# EasyEDA Pro project examples.epro, schematic Schematic5
Create Date: 2026-03-05; Page Name: P1; Project Name: EdaCopilotExamples; Schematic Name: Schematic5; Update Date: 2026-03-05; Company: EasyEDA.com; Page Size: A4; Version: V1.0
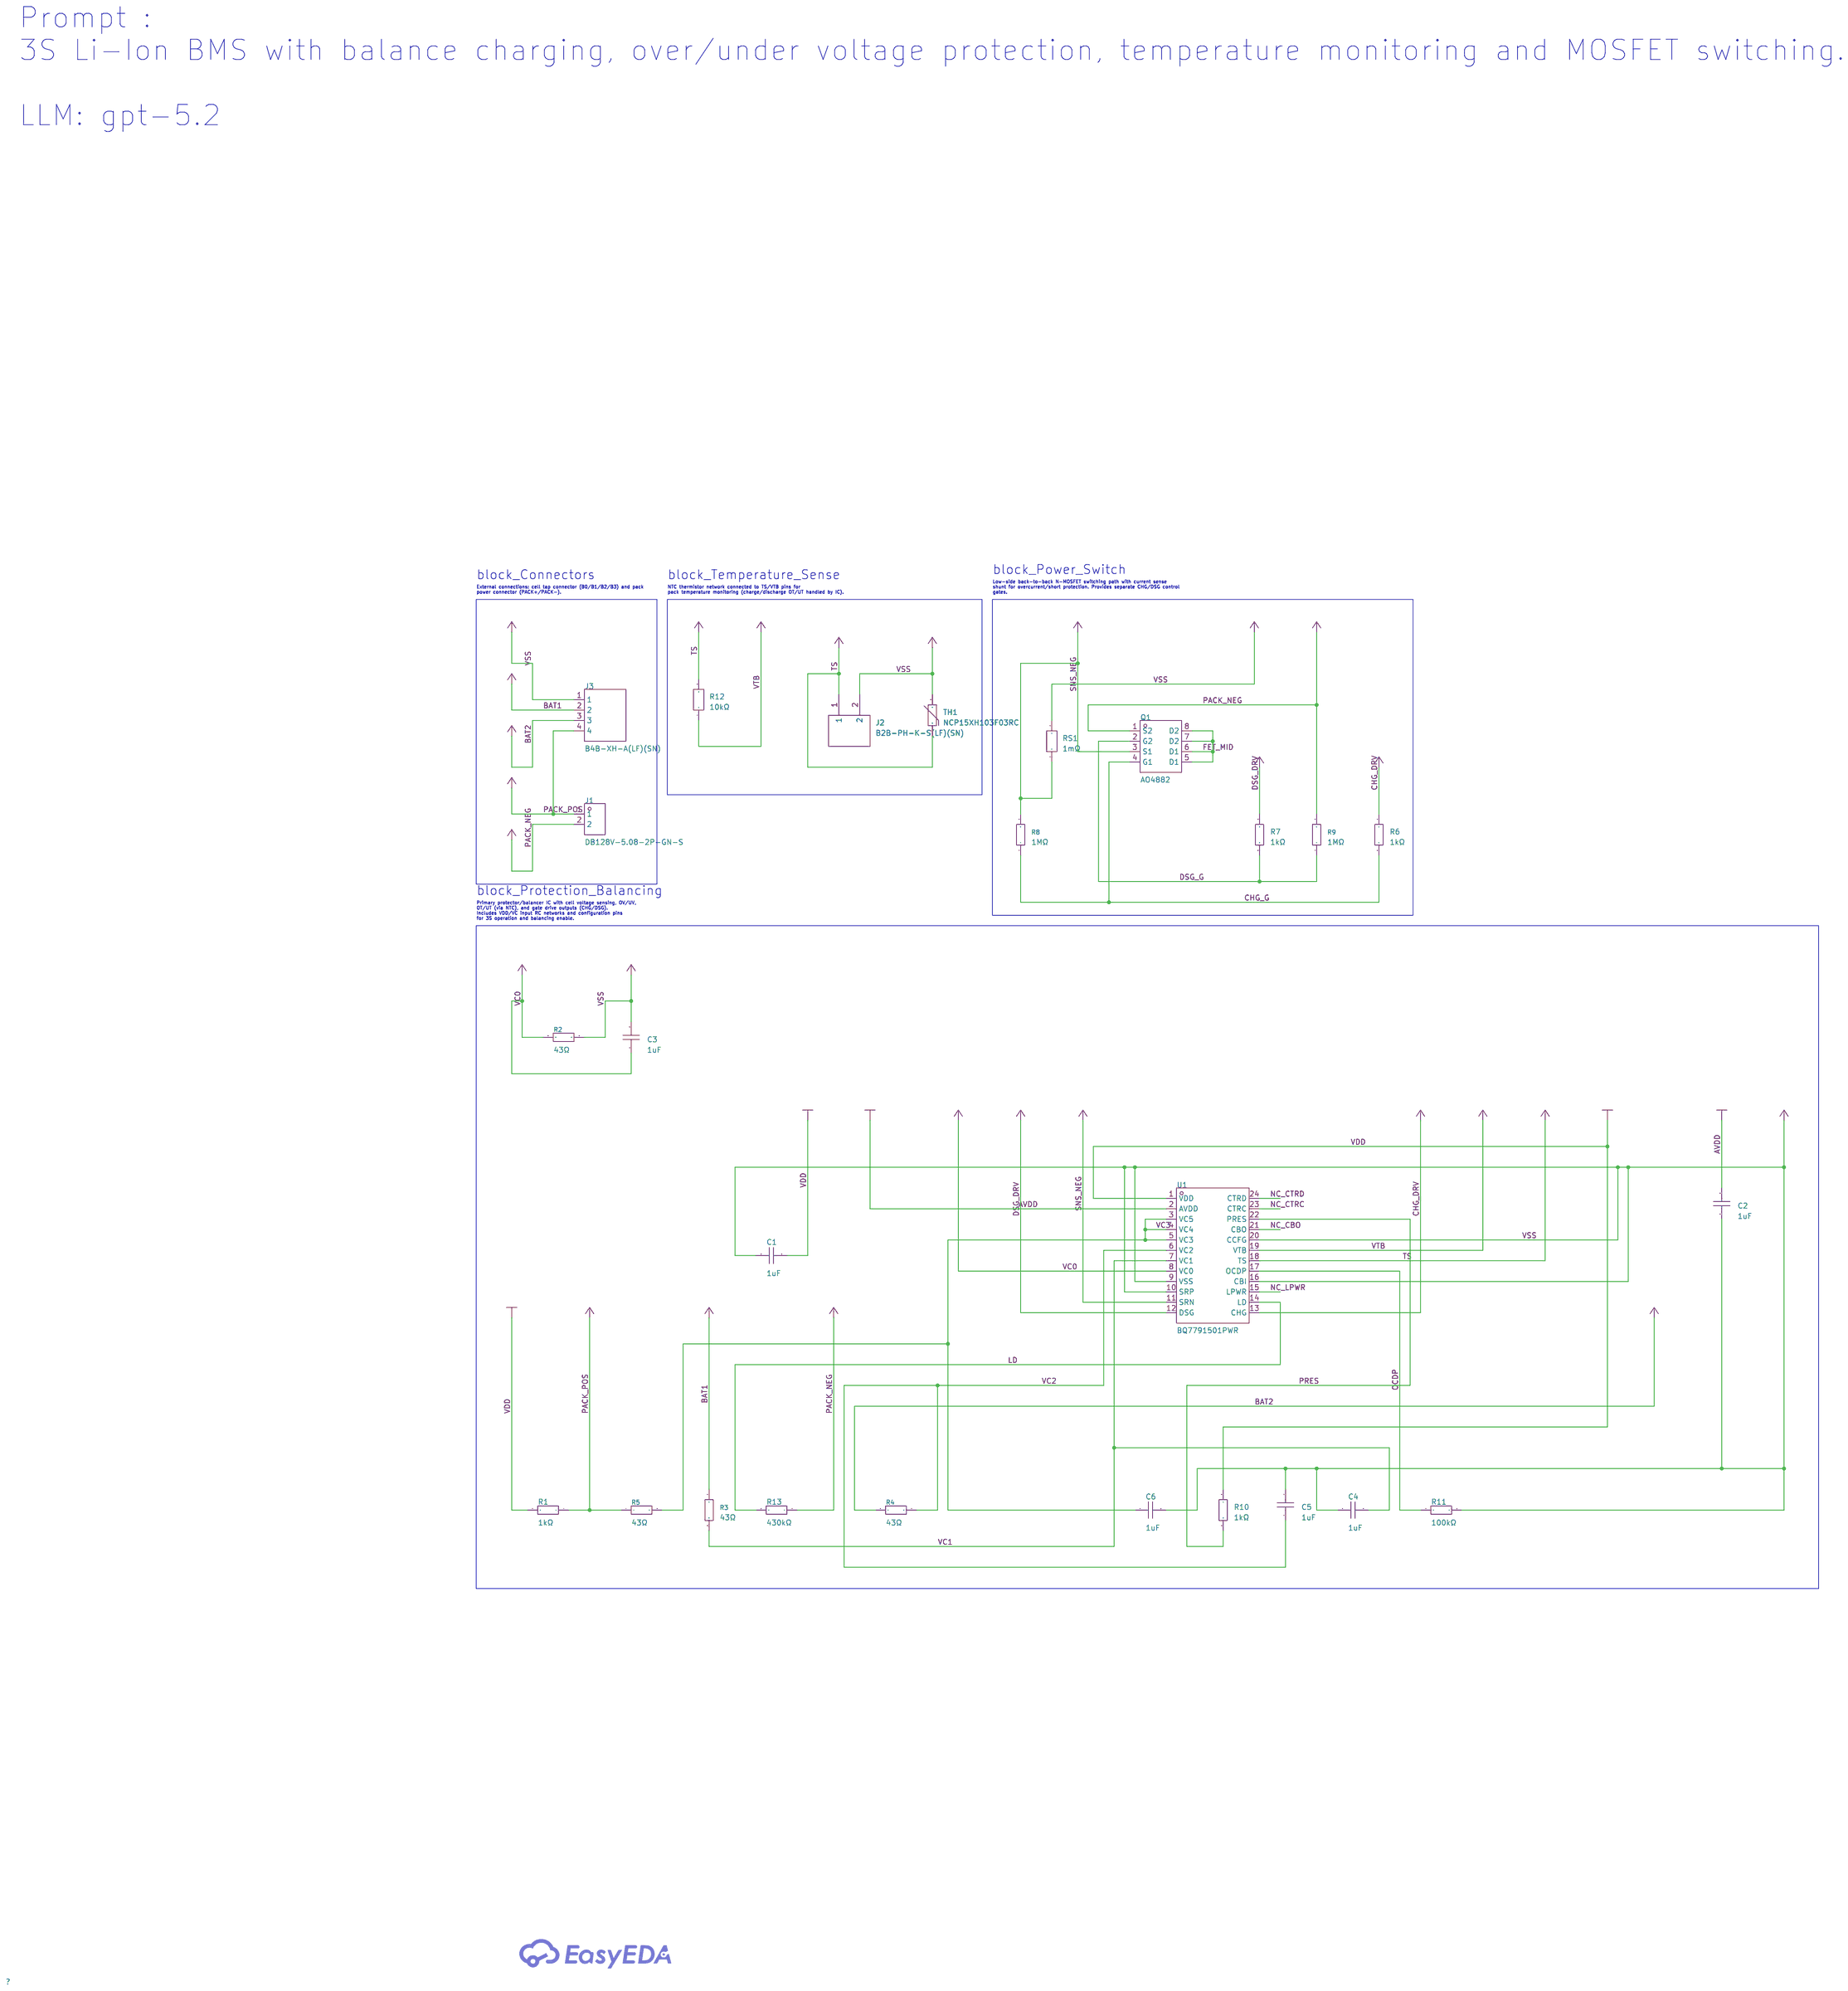
[diagram p4: schematic sheet]

## Parts
C1  1uF  [C0603]
C2  1uF  [C0603]
C3  1uF  [C0603]
C4  1uF  [C0603]
C5  1uF  [C0603]
C6  1uF  [C0603]
J1  DB128V-5.08-2P-GN-S  [CONN-TH_2P-P5.08_DIBO_DB128V-5.08]
J2  B2B-PH-K-S(LF)(SN)  [CONN-TH_B2B-PH-K-S]
J3  B4B-XH-A(LF)(SN)  [CONN-TH_B4B-XH-A-LF-SN]
Q1  AO4882  [SOIC-8_L4.9-W3.9-P1.27-LS6.0-BL]
R1  1kΩ  [R0603]
R2  43Ω  [R0402]
R3  43Ω  [R0402]
R4  43Ω  [R0402]
R5  43Ω  [R0402]
R6  1kΩ  [R0603]
R7  1kΩ  [R0603]
R8  1MΩ  [R0402]
R9  1MΩ  [R0402]
R10  1kΩ  [R0603]
R11  100kΩ  [R0402]
R12  10kΩ  [R0603]
R13  430kΩ  [R0603]
RS1  1mΩ  [R1206]
TH1  NCP15XH103F03RC  [R0402]
U1  BQ7791501PWR  [TSSOP-24_L7.8-W4.4-P0.65-LS6.4-BL]

## Library data of the parts
C1-C6 = CL10B105KA8NNNC: Capacitance:1uF Tolerance:±10% Tolerance:±10% Voltage Rating:25V Temperature Coefficient:X7R; LCSC Part Name: 1uF ±10% 25V; Supplier Part: C29936; Manufacturer: SAMSUNG(三星); Supplier Footprint: 0603; JLCPCB Part Class: Extended Part; Datasheet: https://item.szlcsc.com/datasheet/CL10B105KA8NNNC/30690.html; Supplier: LCSC; Tolerance: ±10%; Voltage Rating: 25V; Temperature Coefficient: X7R; supplier: LCSC; supplierId: C29936
J1 = DB128V-5.08-2P-GN-S: Number of Positions or Pins:1x2P Pitch:5.08mm Color:Green Mounting Type:Through Hole Number of Pins:2P Number of Rows:1 Number of PINs Per Row:2 Screw Specification:M2.5 Current Rating:16A Voltage Rating (Max):300V Wire Gauge - AWG:12~22 Wire Gauge - AWG:; LCSC Part Name: 1x2P 5.08mm 直插 排数:1 每排P数:2; Supplier Part: C2915639; Manufacturer: DORABO(地博电气); Supplier Footprint: 插件,P=5.08mm; JLCPCB Part Class: Extended Part; Datasheet: https://item.szlcsc.com/datasheet/DB128V-5.08-2P-GN-S/3209395.html; Supplier: LCSC; Number of Positions or Pins: 1x2P; Pitch: 5.08mm; Color: Green; Mounting Type: Through Hole; Number of Pins: 2P; Number of Rows: 1; Number of PINs Per Row: 2; Screw Specification: M2.5; Current Rating: 16A; Voltage Rating (Max): 300V; Wire Gauge - AWG: 12~22; Wire Gauge - mm2: 2.5; Operating Temperature: -40℃~+105℃; supplier: LCSC; supplierId: C2915639
J2 = B2B-PH-K-S(LF)(SN): Pins Structure:1x2P Pitch:2mm Mounting Type:Through Hole Reference Series:PH Number of Pins:2P Number of Rows:1 Number of PINs Per Row:2 Row Spacing:- Current Rating:2A Contact Material:Brass Contact Plating:Tin Operating Temperature:-25℃~+85℃ Operating T; LCSC Part Name: 1x2P 间距:2mm 直插 系列:PH; Supplier Part: C131337; Manufacturer: JST; Supplier Footprint: 插件,P=2mm; JLCPCB Part Class: Extended Part; Datasheet: https://item.szlcsc.com/datasheet/B2B-PH-K-S(LF)(SN)/142630.html; Supplier: LCSC; Pins Structure: 1x2P; Pitch: 2mm; Mounting Type: Through Hole; Reference Series: PH; Number of Pins: 2P; Number of Rows: 1; Number of PINs Per Row: 2; Current Rating: 2A; Contact Material: Brass; Contact Plating: Tin; Operating Temperature: -25℃~+85℃; Voltage Rating: 100V; Plastic Material: PA66; Flame Retardant Rating: UL94V-0; Supplementary Features: K Pin; Color: White; Z-Height of the Board: 6mm; X-Length of Bottom Edge on Board (Spacing Line): 5.9mm; Y-Width of Bottom Edge on Board: 4.5mm; supplier: LCSC; supplierId: C131337
J3 = B4B-XH-A(LF)(SN): Pins Structure:1x4P Pitch:2.5mm Mounting Type:Through Hole Reference Series:XH Number of Pins:4P Number of Rows:1 Number of PINs Per Row:4 Row Spacing:- Current Rating:3A Contact Material:Brass Contact Plating:Tin Operating Temperature:-25℃~+85℃ Operating; LCSC Part Name: 1x4P 间距:2.5mm 直插 系列:XH; Supplier Part: C144395; Manufacturer: JST; Supplier Footprint: 插件,P=2.5mm; JLCPCB Part Class: Extended Part; Datasheet: https://item.szlcsc.com/datasheet/B4B-XH-A(LF)(SN)/155727.html; Supplier: LCSC; Pins Structure: 1x4P; Pitch: 2.5mm; Mounting Type: Through Hole; Reference Series: XH; Number of Pins: 4P; Number of Rows: 1; Number of PINs Per Row: 4; Current Rating: 3A; Contact Material: Brass; Contact Plating: Tin; Operating Temperature: -25℃~+85℃; Voltage Rating: 250V; Plastic Material: PA66; Flame Retardant Rating: UL94V-0; Supplementary Features: K Pin; Color: White; Z-Height of the Board: 7mm; X-Length of Bottom Edge on Board (Spacing Line): 12.4mm; Y-Width of Bottom Edge on Board: 5.75mm; supplier: LCSC; supplierId: C144395
Q1 = AO4882_C477943: Number:2 N-Channel Drain to Source Voltage:40V Current - Continuous Drain(Id):40A RDS(on):27mΩ@4.5V,4A Pd - Power Dissipation:- Gate Threshold Voltage (Vgs(th)):2.4V Gate Charge(Qg):6.5nC@10V；3nC@4.5V Input Capacitance(Ciss):415pF Reverse Transfer Capacit; LCSC Part Name: 2个N沟道 耐压:40V; Supplier Part: C477943; Manufacturer: AOS; Supplier Footprint: SOIC-8; JLCPCB Part Class: Extended Part; Datasheet: https://item.szlcsc.com/datasheet/AO4882/485085.html; Supplier: LCSC; Number: 2 N-Channel; Drain to Source Voltage: 40V; Current - Continuous Drain(Id): 40A; RDS(on): 27mΩ@4.5V,4A; Gate Threshold Voltage (Vgs(th)): 2.4V; Gate Charge(Qg): 6.5nC@10V；3nC@4.5V; Input Capacitance(Ciss): 415pF; Reverse Transfer Capacitance (Crss@Vds): 11pF; Operating Temperature: -55℃~+150℃; Output Capacitance(Coss): 112pF; supplier: LCSC; supplierId: C477943
R1 R6 R7 R10 = RC0603FR-071KL: Type:Thick Film Resistor Resistance:1kΩ Tolerance:±1% Tolerance:±1% Power(Watts):100mW Voltage-Supply(Max):75V Temperature Coefficient:±100ppm/℃ Temperature Coefficient:±100ppm/℃ Operating Temperature:-55℃~+155℃ Operating Temperature:-55℃~+155℃; LCSC Part Name: 厚膜电阻 1kΩ ±1% 100mW; Supplier Part: C22548; Manufacturer: YAGEO(国巨); Supplier Footprint: 0603; JLCPCB Part Class: Extended Part; Datasheet: https://item.szlcsc.com/datasheet/RC0603FR-071KL/23274.html; Supplier: LCSC; Type: Thick Film Resistor; Tolerance: ±1%; Power(Watts): 100mW; Voltage-Supply(Max): 75V; Temperature Coefficient: ±100ppm/℃; Operating Temperature: -55℃~+155℃; supplier: LCSC; supplierId: C22548
R2-R5 = 0402WGF430JTCE: Type:Thick Film Resistor Resistance:43Ω Tolerance:±1% Tolerance:±1% Power(Watts):62.5mW Voltage-Supply(Max):50V Temperature Coefficient:±200ppm/℃ Temperature Coefficient:±200ppm/℃ Operating Temperature:-55℃~+155℃ Operating Temperature:-55℃~+155℃; LCSC Part Name: 43Ω ±1% 62.5mW 厚膜电阻; Supplier Part: C270600; Manufacturer: UNI-ROYAL(厚声); Supplier Footprint: 0402; JLCPCB Part Class: Extended Part; Datasheet: https://item.szlcsc.com/datasheet/0402WGF430JTCE/259980.html; Supplier: LCSC; Type: Thick Film Resistor; Tolerance: ±1%; Power(Watts): 62.5mW; Voltage-Supply(Max): 50V; Temperature Coefficient: ±200ppm/℃; Operating Temperature: -55℃~+155℃; supplier: LCSC; supplierId: C270600
R8 R9 = 0402WGF1004TCE: Type:Thick Film Resistor Resistance:1MΩ Tolerance:±1% Tolerance:±1% Power(Watts):62.5mW Voltage-Supply(Max):50V Temperature Coefficient:±100ppm/℃ Temperature Coefficient:±100ppm/℃ Operating Temperature:-55℃~+155℃ Operating Temperature:-55℃~+155℃; LCSC Part Name: 1MΩ ±1% 62.5mW 厚膜电阻; Supplier Part: C26083; Manufacturer: UNI-ROYAL(厚声); Supplier Footprint: 0402; JLCPCB Part Class: Basic Part; Datasheet: https://item.szlcsc.com/datasheet/0402WGF1004TCE/26826.html; Supplier: LCSC; Type: Thick Film Resistor; Tolerance: ±1%; Power(Watts): 62.5mW; Voltage-Supply(Max): 50V; Temperature Coefficient: ±100ppm/℃; Operating Temperature: -55℃~+155℃; supplier: LCSC; supplierId: C26083
R11 = RC0402FR-07100KL: Type:Thick Film Resistor Resistance:100kΩ Tolerance:±1% Tolerance:±1% Power(Watts):62.5mW Voltage-Supply(Max):50V Temperature Coefficient:±100ppm/℃ Temperature Coefficient:±100ppm/℃ Operating Temperature:-55℃~+155℃ Operating Temperature:-55℃~+155℃; LCSC Part Name: 厚膜电阻 100kΩ ±1% 62.5mW; Supplier Part: C60491; Manufacturer: YAGEO(国巨); Supplier Footprint: 0402; JLCPCB Part Class: Extended Part; Datasheet: https://item.szlcsc.com/datasheet/RC0402FR-07100KL/61543.html; Supplier: LCSC; Type: Thick Film Resistor; Tolerance: ±1%; Power(Watts): 62.5mW; Voltage-Supply(Max): 50V; Temperature Coefficient: ±100ppm/℃; Operating Temperature: -55℃~+155℃; supplier: LCSC; supplierId: C60491
R12 = FRC0603J103 TS: Type:Thick Film Resistor Resistance:10kΩ Tolerance:±5% Tolerance:±5% Power(Watts):100mW Voltage-Supply(Max):75V Temperature Coefficient:±100ppm/℃ Temperature Coefficient:±100ppm/℃ Operating Temperature:-55℃~+155℃ Operating Temperature:-55℃~+155℃; LCSC Part Name: 10kΩ ±5% 100mW 厚膜电阻; Supplier Part: C2930027; Manufacturer: FOJAN(富捷); Supplier Footprint: 0603; JLCPCB Part Class: Extended Part; Datasheet: https://item.szlcsc.com/datasheet/FRC0603J103%2520TS/3266960.html; Supplier: LCSC; Type: Thick Film Resistor; Tolerance: ±5%; Power(Watts): 100mW; Voltage-Supply(Max): 75V; Temperature Coefficient: ±100ppm/℃; Operating Temperature: -55℃~+155℃; supplier: LCSC; supplierId: C2930027
R13 = 0603WAF4303T5E: Type:Thick Film Resistor Resistance:430kΩ Tolerance:±1% Tolerance:±1% Power(Watts):100mW Voltage-Supply(Max):75V Temperature Coefficient:±100ppm/℃ Temperature Coefficient:±100ppm/℃ Operating Temperature:-55℃~+155℃ Operating Temperature:-55℃~+155℃; LCSC Part Name: 430kΩ ±1% 100mW 厚膜电阻; Supplier Part: C25969; Manufacturer: UNI-ROYAL(厚声); Supplier Footprint: 0603; JLCPCB Part Class: Extended Part; Datasheet: https://item.szlcsc.com/datasheet/0603WAF4303T5E/26712.html; Supplier: LCSC; Type: Thick Film Resistor; Tolerance: ±1%; Power(Watts): 100mW; Voltage-Supply(Max): 75V; Temperature Coefficient: ±100ppm/℃; Operating Temperature: -55℃~+155℃; supplier: LCSC; supplierId: C25969
RS1 = FRM121WFR001TM: Type:Current Sense Resistor Resistance:1mΩ Tolerance:±1% Tolerance:±1% Voltage Rating:- Power(Watts):1W Current Rating:- Temperature Coefficient:±50ppm/℃ Temperature Coefficient:±50ppm/℃ Mounting Type:-; LCSC Part Name: 1mΩ ±1% 1W; Supplier Part: C7467246; Manufacturer: FOJAN(富捷); Supplier Footprint: 1206; JLCPCB Part Class: Extended Part; Datasheet: https://item.szlcsc.com/datasheet/FRM121WFR001TM/8513846.html; Supplier: LCSC; Type: Current Sense Resistor; Tolerance: ±1%; Power(Watts): 1W; Temperature Coefficient: ±50ppm/℃; supplier: LCSC; supplierId: C7467246
TH1 = NCP15XH103F03RC: Resistance @ 25℃:10kΩ B Constant (25℃/50℃):3380K Resistance Tolerance:±1% Resistance Tolerance:±1% B Constant (25℃/75℃):- B Constant (25℃/85℃):3434K B Constant (25℃/100℃):3455K Power(Watts):100mW B Constant Tolerance:±1% Steady State Current (Max):310uA O; LCSC Part Name: 10kΩ 3380K 100mW; Supplier Part: C77131; Manufacturer: muRata(村田); Supplier Footprint: 0402; JLCPCB Part Class: Extended Part; Datasheet: https://item.szlcsc.com/datasheet/NCP15XH103F03RC/78258.html; Supplier: LCSC; Resistance @ 25℃: 10kΩ; B Constant (25℃/50℃): 3380K; Resistance Tolerance: ±1%; B Constant (25℃/85℃): 3434K; B Constant (25℃/100℃): 3455K; Power(Watts): 100mW; B Constant Tolerance: ±1%; Steady State Current (Max): 310uA; Operating Temperature: -40℃~+125℃; Dissipation Factor: 1mW/℃; Length: 1mm; Width: 0.5mm; supplier: LCSC; supplierId: C77131
U1 = BQ7791501PWR: The Chip Type:- Voltage - Supply:3V~25V Voltage - Supply:3V~25V Charge Current - Max:60mA Charging Saturation Voltage:4.2V End-Off Voltage:2.9V Type of Battery:- Number of Cells:3~5 Number of Cells:3~5 Operating Temperature:-40℃~+85℃ Operating Temperature; LCSC Part Name: 具有电池自主平衡功能和休眠模式的3节至5节串联、可堆叠超低功耗初级保护器; Supplier Part: C2876947; Manufacturer: TI(德州仪器); Supplier Footprint: TSSOP-24; JLCPCB Part Class: Extended Part; Datasheet: https://www.ti.com/cn/lit/gpn/bq77915; Supplier: LCSC; Voltage - Supply: 3V~25V; Charge Current - Max: 60mA; Charging Saturation Voltage: 4.2V; End-Off Voltage: 2.9V; Number of Cells: 3~5; Operating Temperature: -40℃~+85℃; Battery Temperature Detection: Support; Supply Current (Iq): 2uA; Balance Current: 50mA; supplier: LCSC; supplierId: C2876947

## Nets
AVDD: C2.1 U1.2(AVDD)
VDD: C1.1 R1.2 R10.1 U1.1(VDD)
VSS: C1.2 C2.2 C3.2 C4.2 C5.2 C6.2 J2.2 J3.1 R2.1 R11.2 RS1.1 TH1.2 U1.9(VSS) U1.10(SRP) U1.16(CBI) U1.20(CCFG)
BAT1: J3.2 R3.1
BAT2: J3.3 R4.1
CHG_DRV: R6.1 U1.13(CHG)
CHG_G: Q1.4(G1) R6.2 R8.1
DSG_DRV: R7.1 U1.12(DSG)
DSG_G: Q1.2(G2) R7.2 R9.1
FET_MID: Q1.5(D1) Q1.6(D1) Q1.7(D2) Q1.8(D2)
LD: R13.2 U1.14(LD)
NC_CBO: U1.21(CBO)
NC_CTRC: U1.23(CTRC)
NC_CTRD: U1.24(CTRD)
NC_LPWR: U1.15(LPWR)
OCDP: R11.1 U1.17(OCDP)
PACK_NEG: J1.2 Q1.1(S2) R9.2 R13.1
PACK_POS: J1.1 J3.4 R1.1 R5.1
PRES: R10.2 U1.22(PRES)
SNS_NEG: Q1.3(S1) R8.2 RS1.2 U1.11(SRN)
TS: J2.1 R12.2 TH1.1 U1.18(TS)
VC0: C3.1 R2.2 U1.8(VC0)
VC1: C4.1 R3.2 U1.7(VC1)
VC2: C5.1 R4.2 U1.6(VC2)
VC3: C6.1 R5.2 U1.3(VC5) U1.4(VC4) U1.5(VC3)
VTB: R12.1 U1.19(VTB)

## Notes on the sheet
- Prompt :
  3S Li-Ion BMS with balance charging, over/under voltage protection, temperature monitoring and MOSFET switching.
  LLM: gpt-5.2
- block_Connectors
- block_Temperature_Sense
- block_Power_Switch
- External connections: cell tap connector (B0/B1/B2/B3) and pack
  power connector (PACK+/PACK-).
- NTC thermistor network connected to TS/VTB pins for
  pack temperature monitoring (charge/discharge OT/UT handled by IC).
- Low-side back-to-back N-MOSFET switching path with current sense
  shunt for overcurrent/short protection. Provides separate CHG/DSG control
  gates.
- block_Protection_Balancing
- Primary protector/balancer IC with cell voltage sensing, OV/UV,
  OT/UT (via NTC), and gate drive outputs (CHG/DSG).
  Includes VDD/VC input RC networks and configuration pins
  for 3S operation and balancing enable.
